# EasyEDA schematic f9p_rtk.json
TITLE: Sheet_1; REV: 1.0; Date: 2020-10-13; Sheet: 1/1; Drawn By: argedronmarket; Company: Your Company
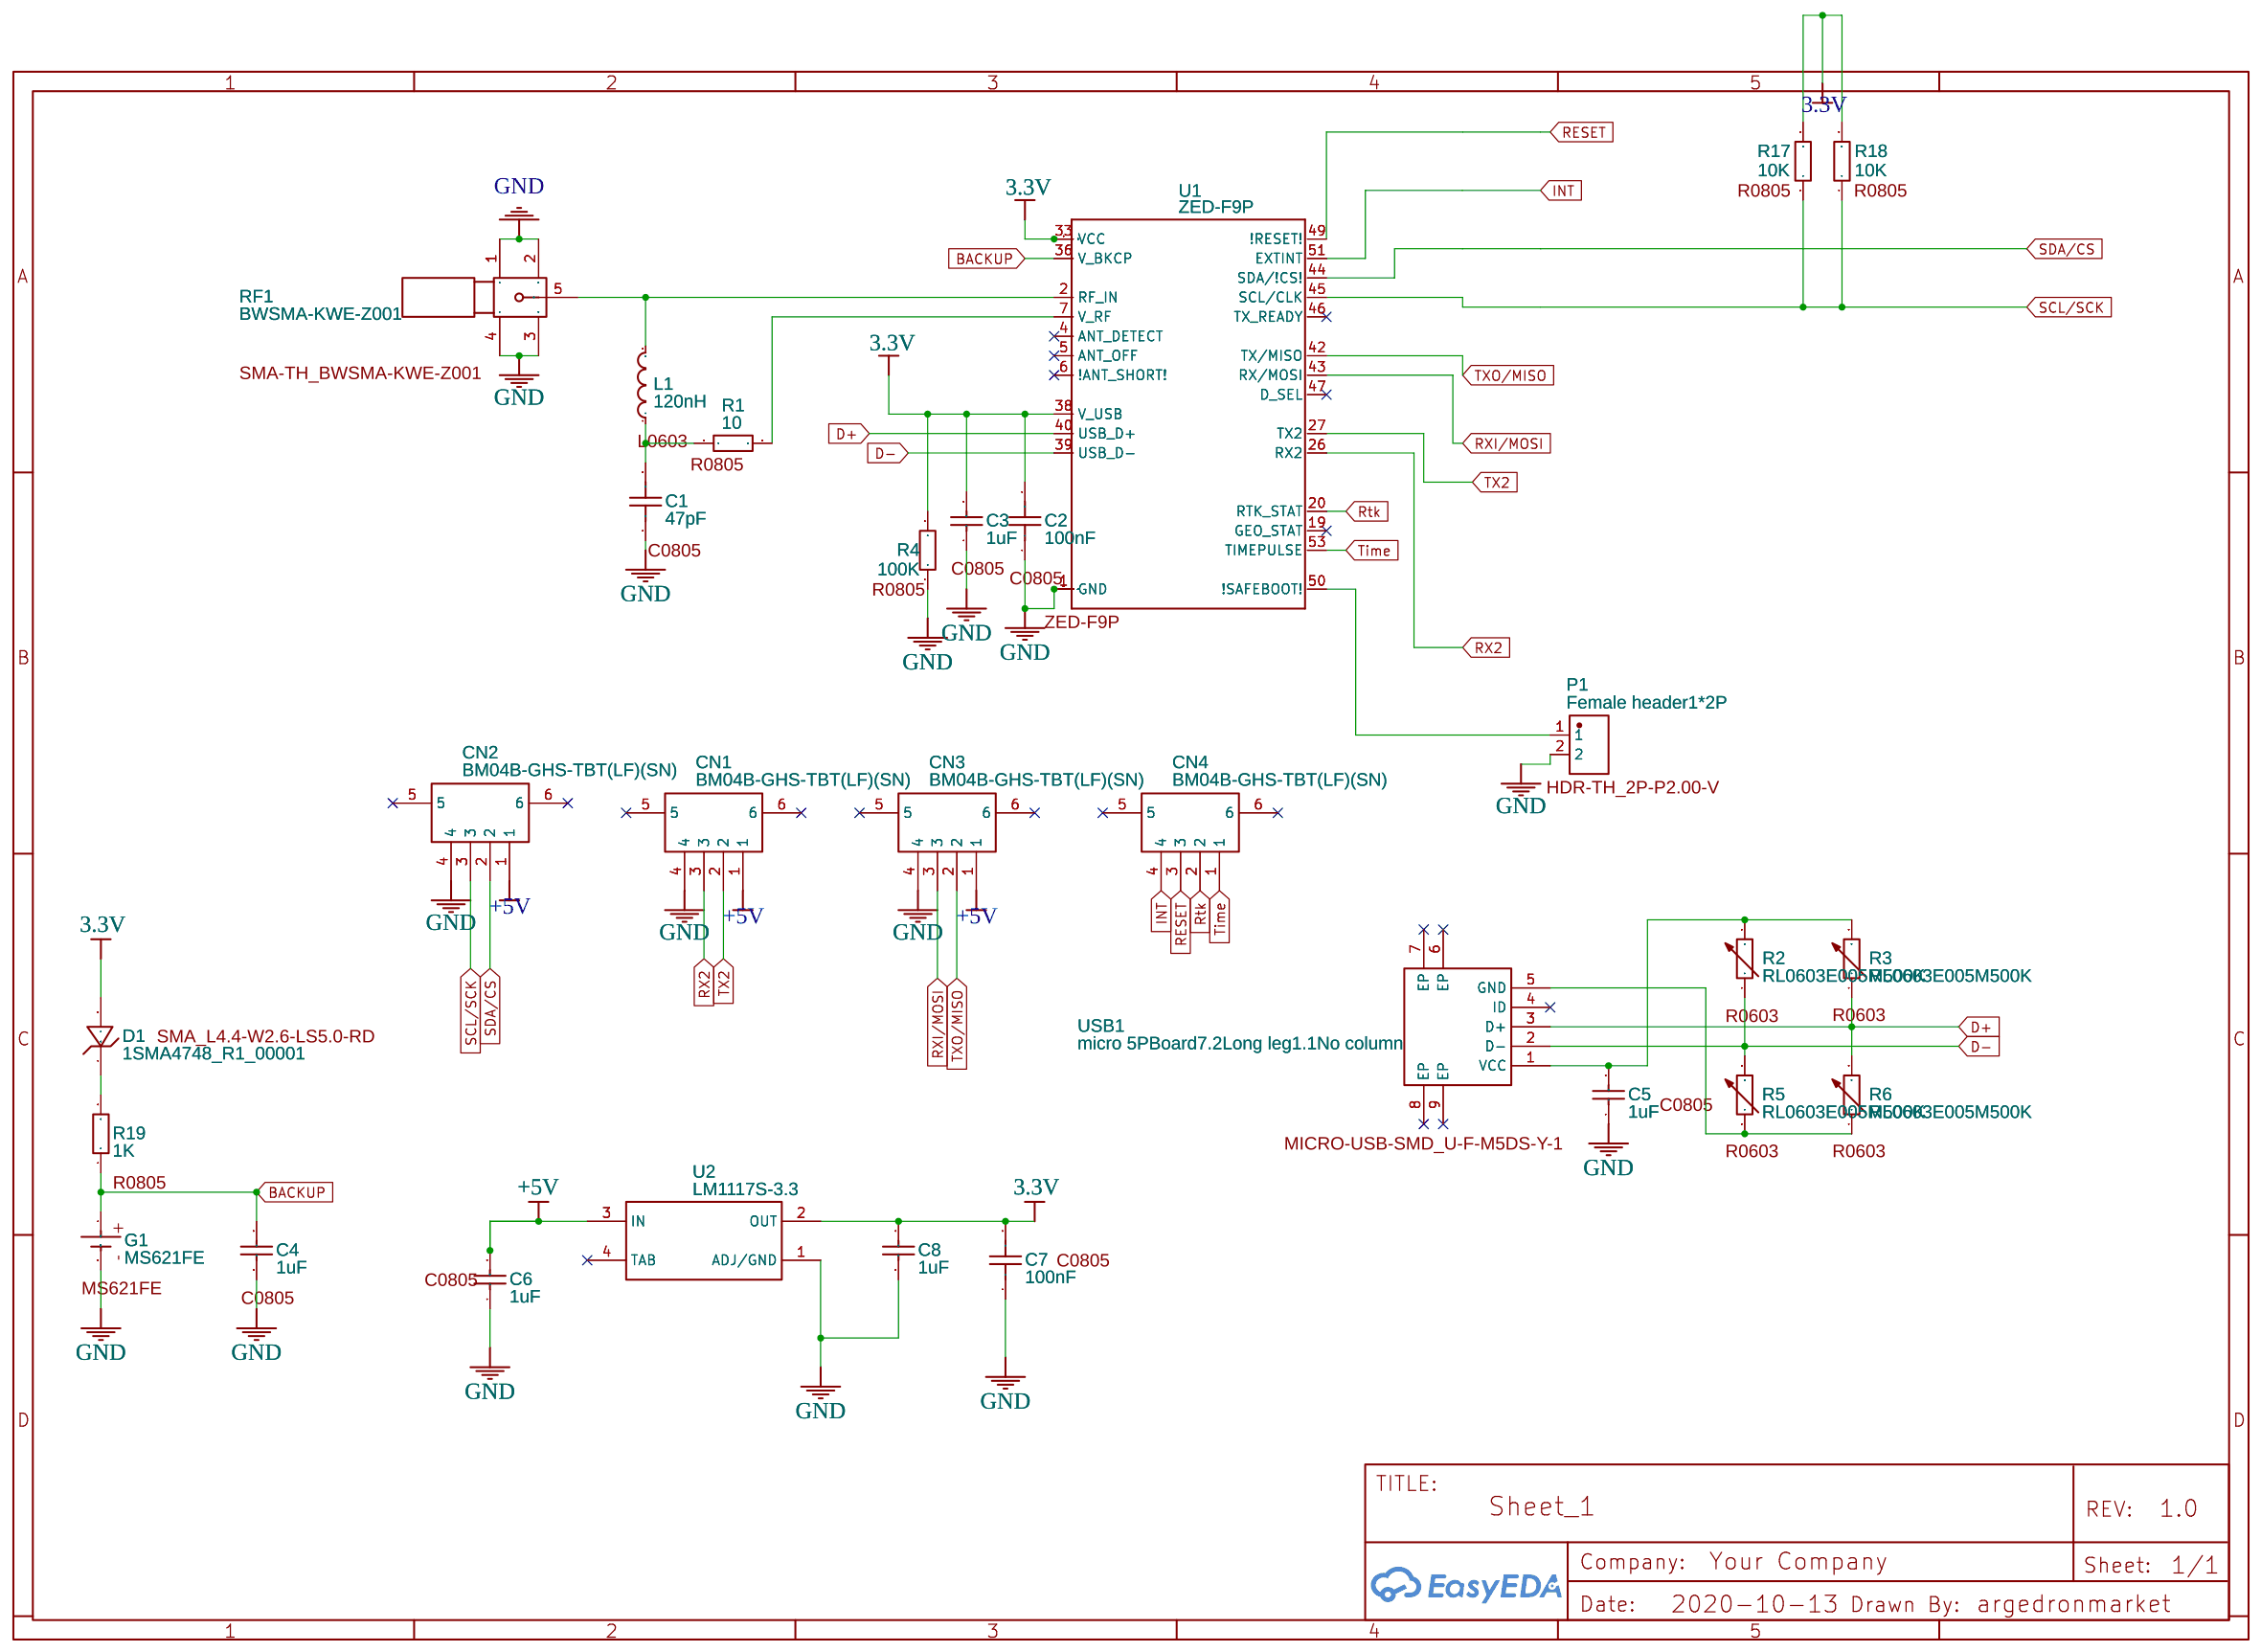
[diagram p0: schematic sheet]

## Parts
C1  47pF  [C0805]
C2  100nF  [C0805]
C3  1uF  [C0805]
C4  1uF  [C0805]
C5  1uF  [C0805]
C6  1uF  [C0805]
C7  100nF  [C0805]
C8  1uF  [C0805]
CN1  BM04B-GHS-TBT(LF)(SN)  [CONN-SMD_4P-P1.25_BM04B-GHS-TBT(LF)(SN)]
CN2  BM04B-GHS-TBT(LF)(SN)  [CONN-SMD_4P-P1.25_BM04B-GHS-TBT(LF)(SN)]
CN3  BM04B-GHS-TBT(LF)(SN)  [CONN-SMD_4P-P1.25_BM04B-GHS-TBT(LF)(SN)]
CN4  BM04B-GHS-TBT(LF)(SN)  [CONN-SMD_4P-P1.25_BM04B-GHS-TBT(LF)(SN)]
D1  1SMA4748_R1_00001  [SMA_L4.4-W2.6-LS5.0-RD]
G1  MS621FE  [MS621FE]
L1  120nH  [L0603]
P1  Female header1*2P  [HDR-TH_2P-P2.00-V]
R1  10  [R0805]
R2  RL0603E005M500K  [R0603]
R3  RL0603E005M500K  [R0603]
R4  100K  [R0805]
R5  RL0603E005M500K  [R0603]
R6  RL0603E005M500K  [R0603]
R17  10K  [R0805]
R18  10K  [R0805]
R19  1K  [R0805]
RF1  BWSMA-KWE-Z001  [SMA-TH_BWSMA-KWE-Z001]
U1  ZED-F9P  [ZED-F9P]
U2  LM1117S-3.3  [SOT-223-3_L6.5-W3.4-P2.30-LS7.0-BR]
USB1  micro 5PBoard7.2Long leg1.1No column  [MICRO-USB-SMD_U-F-M5DS-Y-1]

## Library data of the parts
C1 = 0805N470J500: Supplier: LCSC; Supplier Part: C123648; Manufacturer: Huaxin S&T; Contributor: LCSC; Package Display: Yes
C2 C7 = TCC0805X7R104K101DT: Supplier: LCSC; Supplier Part: C344180; Manufacturer: CCTC; Contributor: LCSC; Package Display: Yes
C3-C6 = 0805F105Z160: Supplier: LCSC; Manufacturer: WTC; Contributor: LCSC; Supplier Part: C123629; Package Display: Yes
C8 = 0805F105Z160: Supplier: LCSC; Manufacturer: WTC; Contributor: LCSC; Supplier Part: C123629; Package Display: No
CN1-CN4 = BM04B-GHS-TBT(LF)(SN): Supplier: LCSC; Supplier Part: C161692; Manufacturer: JST Sales America; Contributor: LCSC
D1 = 1SMA4748_R1_00001: Supplier: LCSC; Supplier Part: C268431; Manufacturer: PANJIT International; Contributor: LCSC; Package Display: Yes
G1 = MS621FE: sourceId: pv1jBvNHY; Package Display: Yes
L1 = CI1608AR12K: Supplier: LCSC; Manufacturer: CEC; Supplier Part: C107493; Package Display: Yes
P1 = Female header1*2P: Supplier: LCSC; Manufacturer: BOOMELE; Supplier Part: C66509; Package Display: Yes
R1 = CR0805F810R0G: Supplier: LCSC; Manufacturer: LIZ; Supplier Part: C101420; Package Display: Yes
R2 R3 R5 R6 = RL0603E005M500K: Supplier: LCSC; Manufacturer: RUILON; Supplier Part: C20960; LCSC Assembly: Yes; SMT Type: Extend; Package Display: Yes
R4 = RS-05K1003FT: Supplier: LCSC; Manufacturer: FH; Supplier Part: C118847; Package Display: Yes
R17 R18 = RS-05K1002FT: Supplier: LCSC; Manufacturer: FH; Supplier Part: C115309; Package Display: Yes
R19 = ARG05FTC1001: Supplier: LCSC; Supplier Part: C218388; Manufacturer: Viking Tech; Contributor: LCSC; Package Display: Yes
RF1 = BWSMA-KWE-Z001: Supplier: LCSC; Supplier Part: C496551; Manufacturer: BAT WIRELESS; Contributor: LCSC; Package Display: Yes
U1 = ZED-F9P: Contributor: Kevin Gregory; Package Display: Yes
U2 = LM1117S-3.3: Supplier: LCSC; Manufacturer: HTC; Supplier Part: C126027; LCSC Assembly: Yes; SMT Type: Extend; Package Display: No
USB1 = micro 5PBoard7.2Long leg1.1No column: Supplier: LCSC; Manufacturer: ValuePro; Supplier Part: C40951; Package Display: Yes

## Nets
3.3V: C2.2 C3.2 C7.2 C8.2 D1.2(A) R4.2 R17.2 R18.2 U1.33(VCC) U1.34(VCC) U1.38(V_USB) U2.2(OUT)
+5V: C6.2 CN1.1 CN2.1 CN3.1 U2.3(IN)
GND: C1.1 C2.1 C3.1 C4.1 C5.1 C6.1 C7.1 C8.1 CN1.4 CN2.4 CN3.4 G1.2(Minus) P1.2 R4.1 RF1.1 RF1.2 RF1.3 RF1.4 U1.1(GND) U1.3(GND) U1.12(GND) U1.14(GND) U1.32(GND) U1.37(GND) U1.41(GND) U1.48(GND) U1.55(GND) U1.56(GND) U1.57(GND) U1.58(GND) U1.59(GND) U1.60(GND) U1.61(GND) U1.62(GND) U1.63(GND) U1.64(GND) U1.65(GND) U1.66(GND) U1.67(GND) U1.68(GND) U1.69(GND) U1.70(GND) U1.71(GND) U1.72(GND) U1.73(GND) U1.74(GND) U1.75(GND) U1.76(GND) U1.77(GND) U1.78(GND) U1.79(GND) U1.80(GND) U1.81(GND) U1.82(GND) U1.83(GND) U1.84(GND) U1.85(GND) U1.86(GND) U1.87(GND) U1.88(GND) U1.89(GND) U1.90(GND) U1.91(GND) U1.92(GND) U1.93(GND) U1.94(GND) U1.95(GND) U1.96(GND) U1.97(GND) U1.98(GND) U1.99(GND) U1.100(GND) U1.101(GND) U1.102(GND) U2.1(ADJ/GND)
BACKUP: C4.2 G1.1(Plus) R19.1 U1.36(V_BKCP)
D+: R3.1 R6.2 U1.40(USB_D+) USB1.3(D+)
D-: R2.1 R5.2 U1.39(USB_D-) USB1.2(D-)
INT: CN4.4 U1.51(EXTINT)
RESET: CN4.3 U1.49(!RESET!)
Rtk: CN4.2 U1.20(RTK_STAT)
RX2: CN1.3 U1.26(RX2)
RXI/MOSI: CN3.3 U1.43(RX/MOSI)
SCL/SCK: CN2.3 R17.1 R18.1 U1.45(SCL/CLK)
SDA/CS: CN2.2 U1.44(SDA/!CS!)
Time: CN4.1 U1.53(TIMEPULSE)
TX2: CN1.2 U1.27(TX2)
TXO/MISO: CN3.2 U1.42(TX/MISO)
Net-(C1-2): C1.2 L1.1 R1.1
Net-(C5-2): C5.2 R2.2 R3.2 USB1.1(VCC)
Net-(D1-1): D1.1(C) R19.2
Net-(L1-2): L1.2 RF1.5 U1.2(RF_IN)
Net-(P1-1): P1.1 U1.50(!SAFEBOOT!)
Net-(R1-2): R1.2 U1.7(V_RF)
Net-(R5-1): R5.1 R6.1 USB1.5(GND)

Not connected (* = marked no-connect by the designer): CN1 5* 6*; CN2 5* 6*; CN3 5* 6*; CN4 5* 6*; U1 4(ANT_DETECT)* 5(ANT_OFF)* 6(!ANT_SHORT!)* 19(GEO_STAT)* 46(TX_READY)* 47(D_SEL)*; U2 4(TAB)*; USB1 4(ID)* 6(EP)* 7(EP)* 8(EP)* 9(EP)*
